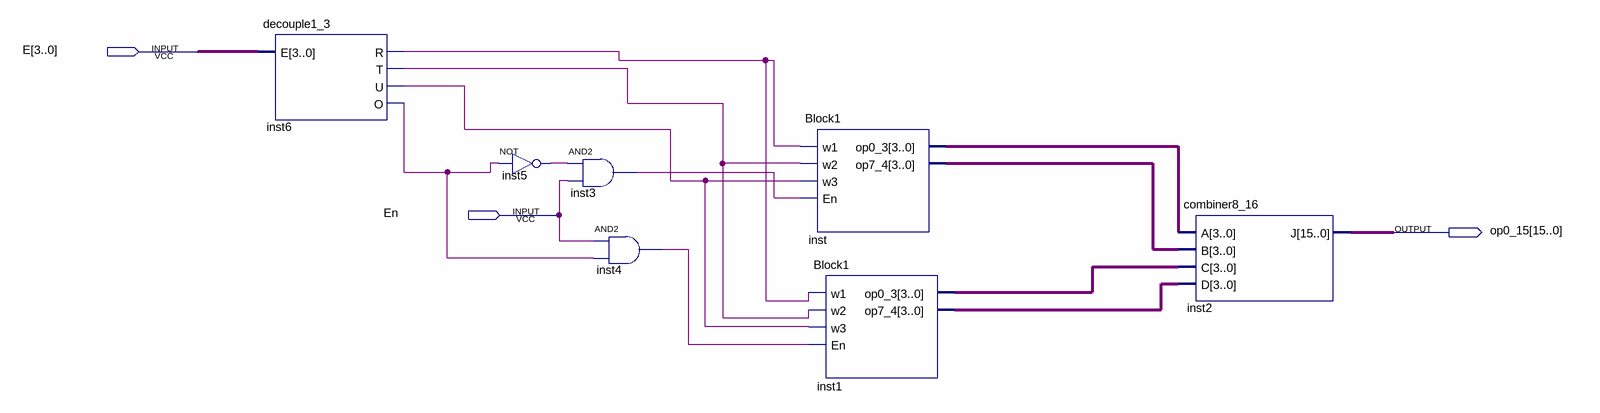
[diagram p0: schematic sheet]
// Quartus schematic 4to16decod.bdf as structural Verilog: 7 symbols, 3 pins
module \4to16decod  (
  input  [3:0] E,
  input  En,
  output [15:0] op0_15
);

  wire inst3_out, inst4_out, inst5_out, inst6_o, inst6_r, inst6_t, inst6_u;
  wire [3:0] inst1_op0_3, inst1_op7_4, inst_op0_3, inst_op7_4;

  decouple1_3 inst6 (.E(E), .R(inst6_r), .T(inst6_t), .U(inst6_u), .O(inst6_o));
  not inst5 (inst5_out, inst6_o);
  and inst3 (inst3_out, inst5_out, En);
  and inst4 (inst4_out, En, inst6_o);
  Block1 inst (.w1(inst6_r), .w2(inst6_t), .w3(inst6_u), .En(inst3_out), .op0_3(inst_op0_3), .op7_4(inst_op7_4));
  Block1 inst1 (.w1(inst6_r), .w2(inst6_t), .w3(inst6_u), .En(inst4_out), .op0_3(inst1_op0_3), .op7_4(inst1_op7_4));
  combiner8_16 inst2 (.A(inst_op0_3), .B(inst_op7_4), .C(inst1_op0_3), .D(inst1_op7_4), .J(op0_15));
endmodule
